# Altium schematic sheet PowerSupply.SchDoc: Iris
size A3; Organization: Toradex AG; Address1: Altsagenstrasse 5; Address2: Horw; Address3: 6048; Address4: Switzerland; DocumentNumber: 3; Revision: V2.0; SheetNumber: 3; SheetTotal: 16
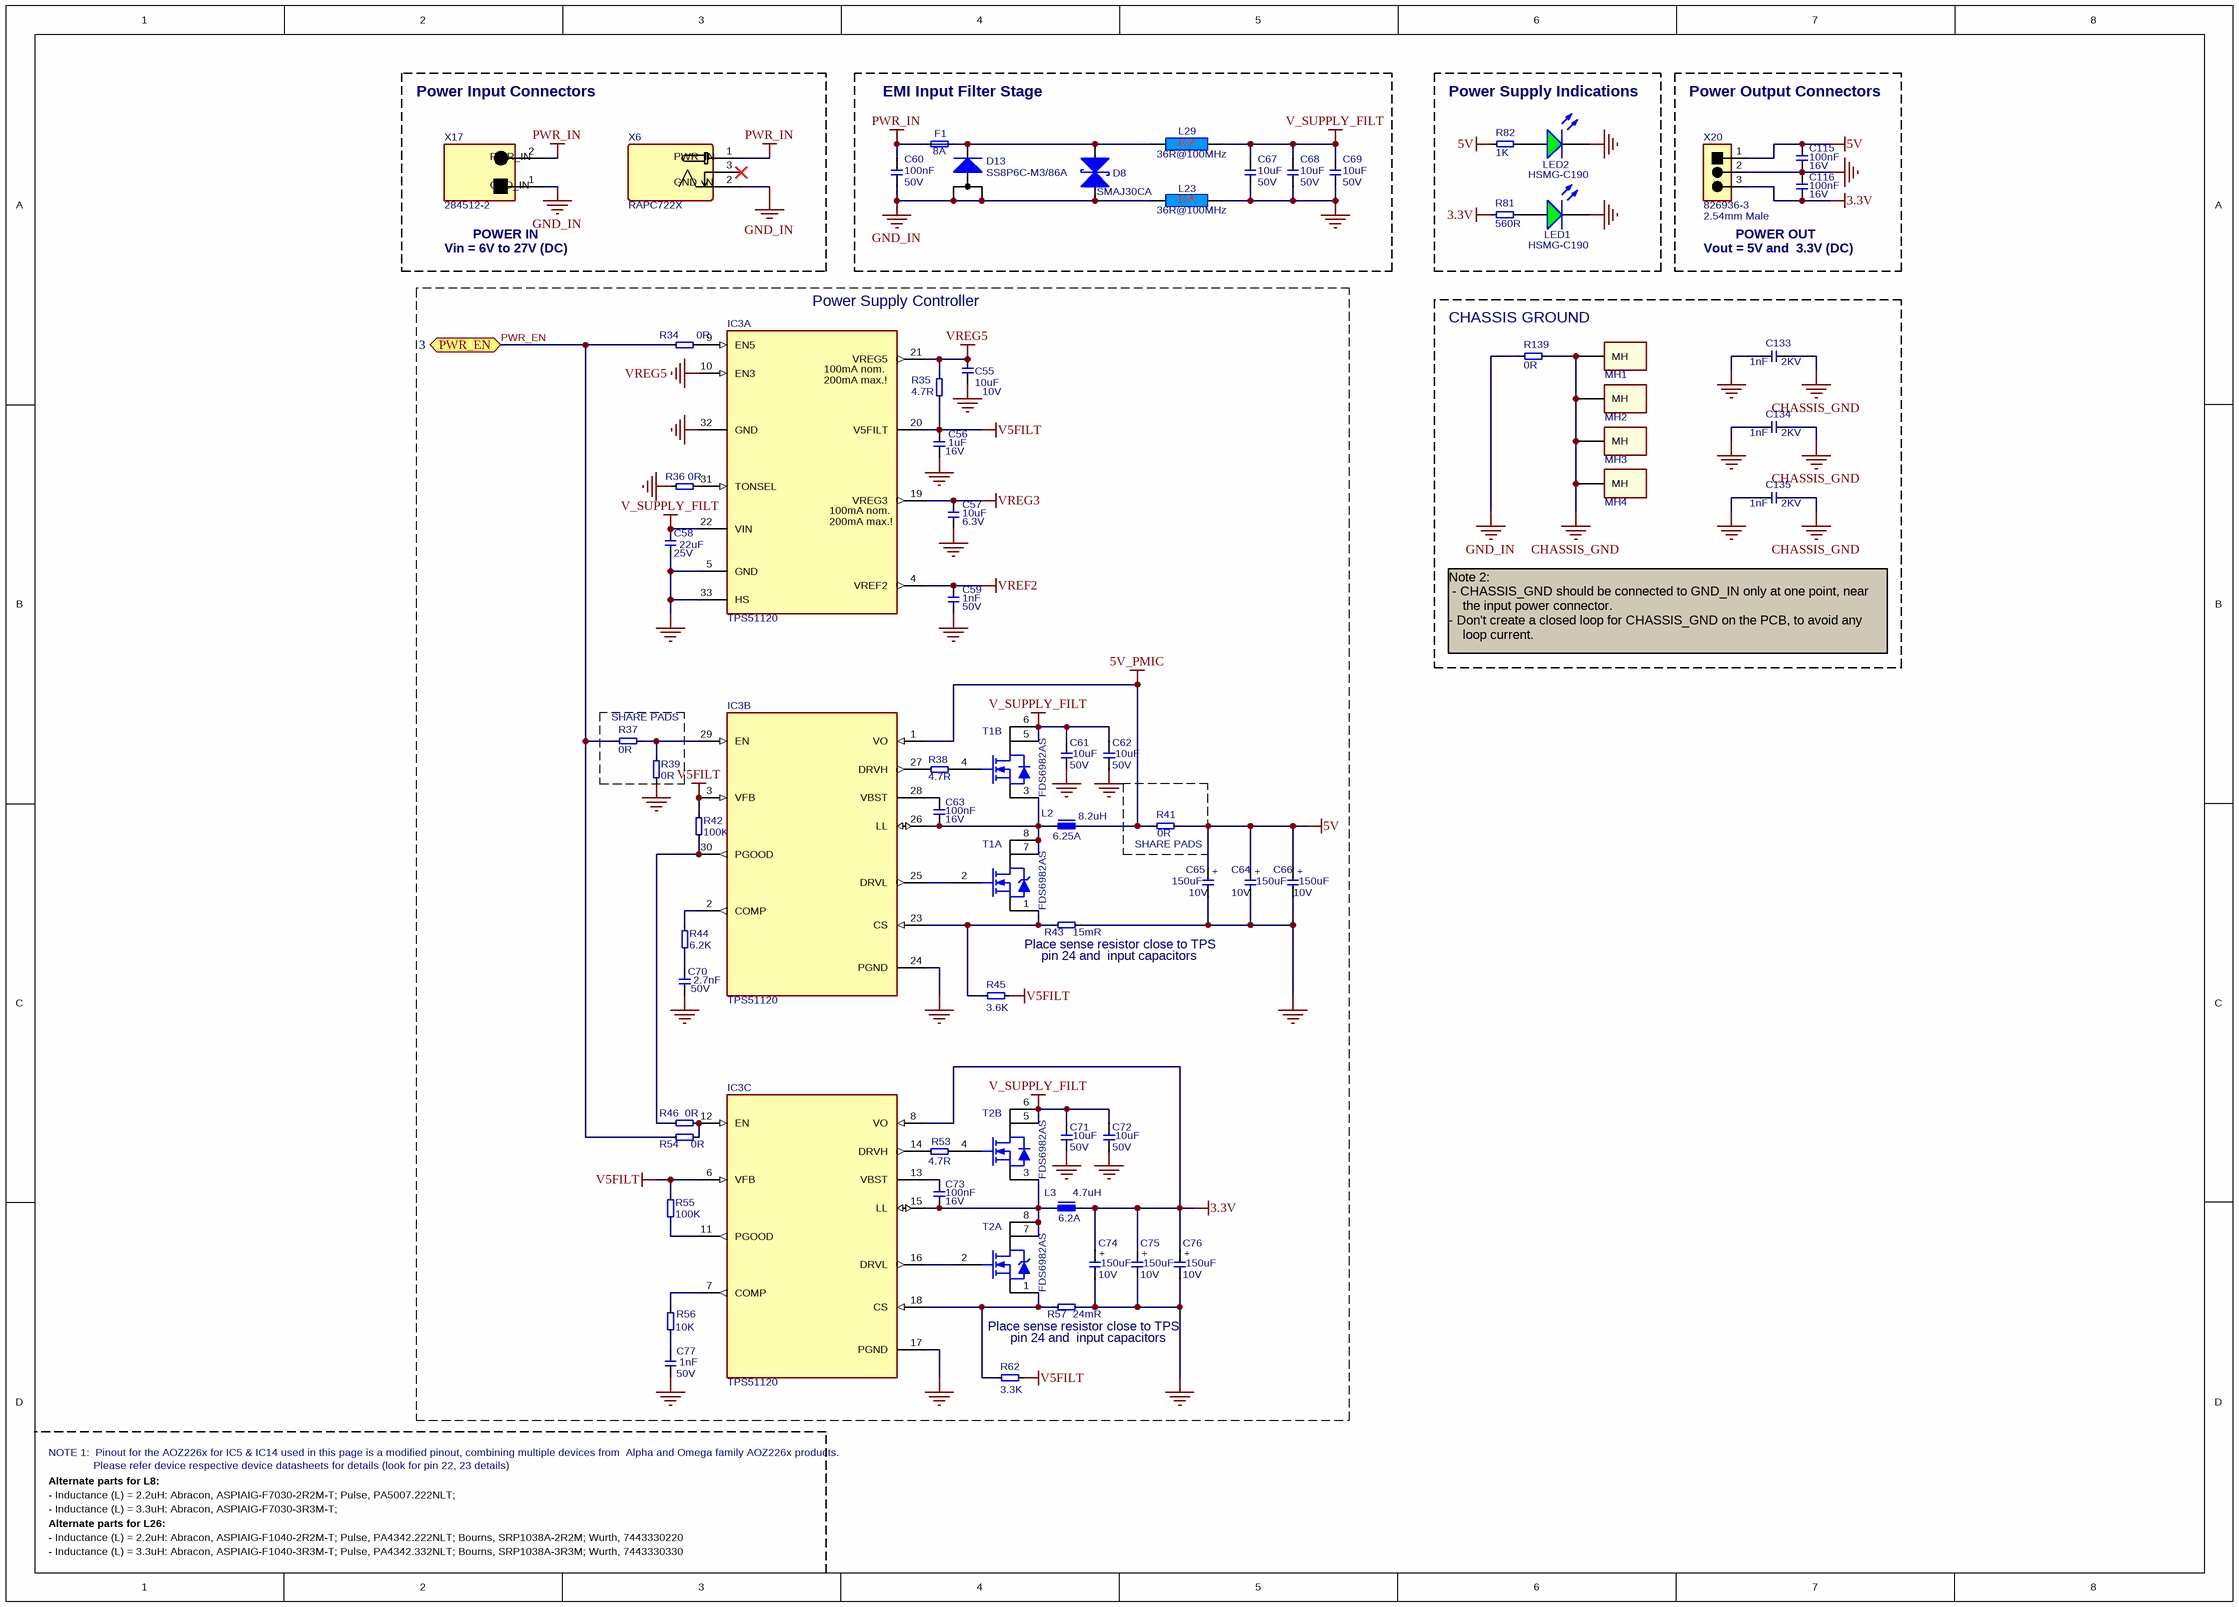
[diagram p0: PowerSupply.SchDoc]

## Parts
C55  Rating: 10V  [T_CAPC0805X125N]  (hidden comment: 10uF)
C56  Rating: 16V  [T_CAPC0603X33N]  (hidden comment: 1uF)
C57  Rating: 6.3V  [T_CAPC0603X33N]  (hidden comment: 10uF)
C58  Rating: 25V  [CAPC3225X160N]  (hidden comment: 22uF)
C59  Rating: 50V  [T_CAPC0603X33N]  (hidden comment: 1nF)
C60  Rating: 50V  [T_CAPC0603X33N]  (hidden comment: 100nF)
C61  Rating: 50V  [CAPC3225X160N]  (hidden comment: 10uF)
C62  Rating: 50V  [CAPC3225X160N]  (hidden comment: 10uF)
C63  Rating: 16V  [T_CAPC0603X33N]  (hidden comment: 100nF)
C64  Rating: 10V  [CAPMP7343X310N]  (hidden comment: 150uF)
C65  Rating: 10V  [CAPMP7343X310N]  (hidden comment: 150uF)
C66  Rating: 10V  [CAPMP7343X310N]  (hidden comment: 150uF)
C67  Rating: 50V  [CAPC3225X160N]  (hidden comment: 10uF)
C68  Rating: 50V  [CAPC3225X160N]  (hidden comment: 10uF)
C69  Rating: 50V  [CAPC3225X160N]  (hidden comment: 10uF)
C70  Rating: 50V  [CAPC1005X60N]  (hidden comment: 2.7nF)
C71  Rating: 50V  [CAPC3225X160N]  (hidden comment: 10uF)
C72  Rating: 50V  [CAPC3225X160N]  (hidden comment: 10uF)
C73  Rating: 16V  [T_CAPC0603X33N]  (hidden comment: 100nF)
C74  Rating: 10V  [CAPMP7343X310N]  (hidden comment: 150uF)
C75  Rating: 10V  [CAPMP7343X310N]  (hidden comment: 150uF)
C76  Rating: 10V  [CAPMP7343X310N]  (hidden comment: 150uF)
C77  Rating: 50V  [T_CAPC0603X33N]  (hidden comment: 1nF)
C115  Rating: 16V  [CAPC1005X60N]  (hidden comment: 100nF)
C116  Rating: 16V  [CAPC1005X60N]  (hidden comment: 100nF)
C133  Rating: 2KV  [T_CAPC1206X180N]  (hidden comment: 1nF)
C134  Rating: 2KV  [T_CAPC1206X180N]  (hidden comment: 1nF)
C135  Rating: 2KV  [T_CAPC1206X180N]  (hidden comment: 1nF)
D8  Manufacturer Part No.: SMAJ30CA  [T_LITTLEFUSE_SMAJ30CA]  (hidden comment: D-Littelfuse-SMAJ30CA-Schottky)
D13  SS8P6C-M3/86A  [T_DIOM_TO277A]
F1  8A  [T_Littelfuse_0458]
IC3  TPS51120  [QFN50P500X500X100-33N]  (parts A,B,C of 3)
L2  Rating: 6.25A  [T_INDM120120X80N]  (hidden comment: 8.2uH)
L3  Rating: 6.2A  [T_INDM102102X45N]  (hidden comment: 4.7uH)
L23  36R@100MHz  [T_Laird_35F0121-0SR-10]
L29  36R@100MHz  [T_Laird_35F0121-0SR-10]
LED1  Manufacturer Part No.: HSMG-C190  [LEDC1608X80N]  (hidden comment: LED)
LED2  Manufacturer Part No.: HSMG-C190  [LEDC1608X80N]  (hidden comment: LED)
MH1  MECH-MountingHoles  [T_MountingHoles]  (value not drawn)  (no BOM)
MH2  MECH-MountingHoles  [T_MountingHoles]  (value not drawn)  (no BOM)
MH3  MECH-MountingHoles  [T_MountingHoles]  (value not drawn)  (no BOM)
MH4  MECH-MountingHoles  [T_MountingHoles]  (value not drawn)  (no BOM)
R34  0R  [T_RESC0603X30N]
R35  4.7R  [RESC1005X40N]
R36  0R  [T_RESC0603X30N]
R37  0R  [T_RESC3216X760N]
R38  4.7R  [RESC1005X40N]
R39  0R  [T_RESC3216X760N]
R41  0R  [CAPC1608X100N]
R42  100K  [T_RESC0603X30N]
R43  15mR  [RESC3316X76N]
R44  6.2K  [RESC1005X40N]
R45  3.6K  [T_RESC0603X30N]
R46  0R  [T_RESC0603X30N]
R53  4.7R  [RESC1005X40N]
R54  0R  [T_RESC0603X30N]
R55  100K  [T_RESC0603X30N]
R56  10K  [RESC1005X40N]
R57  24mR  [RESC3316X76N]
R62  3.3K  [T_RESC0603X30N]
R81  560R  [RESC1005X40N]
R82  1K  [RESC1005X40N]
R139  0R  [T_RESC3216X760N]
T1  FDS6982AS  [SOIC127P600X173-8N]  (parts A,B of 2)
T2  FDS6982AS  [SOIC127P600X173-8N]  (parts A,B of 2)
X6  RAPC722X  [CTBP9358/3]
X17  284512-2  [T_TYCO_284512-2]
X20  826936-3  [T_TYCO_826936-3]

## Blocks framed on the sheet
Power Input Connectors: X6 X17
EMI Input Filter Stage: C60 C67-C69 D8 D13 F1 L23 L29
Power Supply Indications: LED1 LED2 R81 R82
Power Output Connectors: C115 C116 X20
Power Supply Controller: C55-C59 C61-C66 C70-C77 IC3 L2 L3 R34-R36 R38 R42-R46 R53-R57 R62 T1 T2
CHASSIS GROUND: C133-C135 MH1-MH4 R139
SHARE PADS: R37 R39
SHARE PADS: R41

## Ports
PWR_EN (bidir, see 3)

## Nets
3.3V: C74.1 C75.1 C76.1 C116.1 IC3.8(VO) L3.2 R81.2 X20.3
5V: C64.1 C65.1 C66.1 C115.2 R41.2 R82.2 X20.1
5V_PMIC: IC3.1(VO) L2.2 R41.1
CHASSIS_GND: C133.1 C134.1 C135.1 MH1.1(MH) MH2.1(MH) MH3.1(MH) MH4.1(MH) R139.2
GND: C55.1 C56.1 C57.1 C58.1 C59.1 C61.1 C62.1 C64.2 C65.2 C66.2 C67.1 C68.1 C69.1 C70.1 C71.1 C72.1 C74.2 C75.2 C76.2 C77.1 C115.1 C116.2 C133.2 C134.2 C135.2 IC3.5(GND) IC3.17(PGND) IC3.24(PGND) IC3.32(GND) IC3.33(HS) L23.2 LED1.1(K) LED2.1(K) R36.1 R39.1 R43.2 R57.2 X20.2
GND_IN: C60.1 D8.2(Anode) D13.A1 D13.A2 L23.1 R139.1 X6.2(PWR_IN) X17.1(GND_IN)
PWR_IN: C60.2 F1.1 X6.1(GND_IN) X17.2(PWR_IN)
V5FILT: C56.2 IC3.3(VFB) IC3.6(VFB) IC3.20(V5FILT) R35.1 R42.2 R45.2 R55.2 R62.2
V_SUPPLY_FILT: C58.2 C61.2 C62.2 C67.2 C68.2 C69.2 C71.2 C72.2 IC3.22(VIN) L29.2 T1.5(D) T1.6(D) T2.5(D) T2.6(D)
VREF2: C59.2 IC3.4(VREF2)
VREG3: C57.2 IC3.19(VREG3)
VREG5: C55.2 IC3.10(EN3) IC3.21(VREG5) R35.2
PWR_EN: R34.1 R37.1 R54.1 ; port PWR_EN
NetC63_1: C63.1 IC3.26(LL) L2.1 T1.3(S) T1.7(D) T1.8(D)
NetC63_2: C63.2 IC3.28(VBST)
NetC70_2: C70.2 R44.1
NetC73_1: C73.1 IC3.15(LL) L3.1 T2.3(S) T2.7(D) T2.8(D)
NetC73_2: C73.2 IC3.13(VBST)
NetC77_2: C77.2 R56.1
NetD8_1: D8.1(Cathode) D13.K F1.2 L29.1
NetIC3_2: IC3.2(COMP) R44.2
NetIC3_7: IC3.7(COMP) R56.2
NetIC3_9: IC3.9(EN5) R34.2
NetIC3_11: IC3.11(PGOOD) R55.1
NetIC3_12: IC3.12(EN) R46.2 R54.2
NetIC3_14: IC3.14(DRVH) R53.1
NetIC3_16: IC3.16(DRVL) T2.2(G)
NetIC3_18: IC3.18(CS) R57.1 R62.1 T2.1(S)
NetIC3_23: IC3.23(CS) R43.1 R45.1 T1.1(S)
NetIC3_25: IC3.25(DRVL) T1.2(G)
NetIC3_27: IC3.27(DRVH) R38.1
NetIC3_29: IC3.29(EN) R37.2 R39.2
NetIC3_30: IC3.30(PGOOD) R42.1 R46.1
NetIC3_31: IC3.31(TONSEL) R36.2
NetLED1_2: LED1.2(A) R81.1
NetLED2_2: LED2.2(A) R82.1
NetR38_2: R38.2 T1.4(G)
NetR53_2: R53.2 T2.4(G)

Not connected (* = marked no-connect by the designer): X6 3(PWR_IN)*

## Notes on the sheet
- (near X17) Vin = 6V to 27V (DC)
- (near X17) POWER IN
- Vout = 5V and  3.3V (DC)
- (near X20) 2.54mm Male
- POWER OUT
- Note 2:
  - CHASSIS_GND should be connected to GND_IN only at one point, near
  the input power connector.
  - Don't create a closed loop for CHASSIS_GND on the PCB, to avoid any
  loop current.
- (near R43) Place sense resistor close to TPS
- (near R43) pin 24 and  input capacitors
- (near R57) Place sense resistor close to TPS
- pin 24 and  input capacitors
- NOTE 1:  Pinout for the AOZ226x for IC5 & IC14 used in this page is a modified pinout, combining multiple devices from  Alpha and Omega family AOZ226x products.
- Alternate parts for L8:
- Please refer device respective device datasheets for details (look for pin 22, 23 details)
- Alternate parts for L26:
- - Inductance (L) = 3.3uH: Abracon, ASPIAIG-F1040-3R3M-T; Pulse, PA4342.332NLT; Bourns, SRP1038A-3R3M; Wurth, 7443330330
- - Inductance (L) = 2.2uH: Abracon, ASPIAIG-F1040-2R2M-T; Pulse, PA4342.222NLT; Bourns, SRP1038A-2R2M; Wurth, 7443330220
- - Inductance (L) = 3.3uH: Abracon, ASPIAIG-F7030-3R3M-T;
- - Inductance (L) = 2.2uH: Abracon, ASPIAIG-F7030-2R2M-T; Pulse, PA5007.222NLT;
- Title
- Size:
- Date:
- A3
- Number:
- Time:
- Revision:
- Sheet
- of
- File:
- (in symbol C-TA-150uF-10V-10%-7343) +
- (in symbol IC-TI-TPS51120, part A) 100mA nom.; 200mA max.!

## Library data of the parts
C55 = C-X5R-10uF-10V-20%-0805: Capacitor Ceramic X5R 10uF 10V 20% 0805; Tolerance: 20%; Type: X5R; Value: 10uF
C56 = C-X5R-1uF-16V-20%-0603: Capacitor Ceramic X5R 1uF 16V 20% 0603; Tolerance: 20%; Type: X5R; Value: 1uF
C57 = C-X5R-10uF-6.3V-20%-0603: Capacitor Ceramic X5R 10uF 6.3V 20% 0603; Tolerance: 20%; Type: X5R; Value: 10uF
C58 = C-X5R-22uF-25V-20%-1210: Capacitor Ceramic X5R 22uF 25V 20% 1210; Tolerance: 20%; Type: X5R; Value: 22uF
C59 C77 = C-X7R-1nF-50V-10%-0603: Capacitor Ceramic X7R 1nF 50V 10% 0603; Tolerance: 10%; Type: X7R; Value: 1nF
C60 = C-X7R-100nF-50V-10%-0603: Capacitor Ceramic X7R 100nF 50V 10% 0603; Tolerance: 10%; Type: X7R; Value: 100nF
C61 C62 C71 C72 = C-X5R-10uF-50V-20%-1210: Capacitor Ceramic X5R 10uF 50V 20% 1210; Tolerance: 20%; Type: X5R; Value: 10uF
C63 C73 = C-X7R-100nF-16V-10%-0603: Capacitor Ceramic X7R 100nF 16V 10% 0603; Tolerance: 10%; Type: X7R; Value: 100nF
C64-C66 C74-C76 = C-TA-150uF-10V-10%-7343: Capacitor TA 150uF 10V 20% 7343; Tolerance: 10%; Type: TA; Value: 150uF
C67-C69 = C-X5R-10uF-50V-10%-1210: Capacitor Ceramic X5R 10uF 50V 10% 1210; Tolerance: 10%; Type: X5R; Value: 10uF
C70 = C-X7R-2.7nF-50V-10%-0402: Capacitor Ceramic X7R 2.7nF 50V 10% 0402; Tolerance: 10%; Type: X7R; Value: 2.7nF
C115 C116 = C-X7R-100nF-16V-10%-0402: Capacitor Ceramic X7R 100nF 16V 10% 0402; Tolerance: 10%; Type: X7R; Value: 100nF
C133-C135 = C-X7R-1nF-2KV-10%-1206: Capacitor Ceramic X7R 1nF 2KV 10% 1206; Tolerance: 10%; Type: X7R; Value: 1nF
D8 = D-Littelfuse-SMAJ30CA-Schottky: Bidirectional ESD protection; Manufacturer Name: Littelfuse
D13 = D-Vishay-SS8P6C-M3/86A: Diode Schottky, SS8P6C-M3/86A, 60V(Vrrm), 8A(If); Manufacturer: Vishay; Manufacturer Part Number: SS8P6C-M3/86A
F1 = F-Littelfuse-0458008.DR: Fast Fuse, Rated 8A, 63V(DC), 1206 (3216 Metric); Manufacturer Part No.: 0458008.DR; Manufacturer Name: Littelfuse; Value: 8A
IC3 = IC-TI-TPS51120: Power Supply Controller; Manufacturer Name: Texas Instruments; Manufacturer Part No.: TPS51120
L2 = L-Wurth-744771008-8.2uH-6.25A-20%: Inductance 8.2uH 6.25A 20%; Manufacturer Name: Wurth; Tolerance: 20%; Manufacturer Part No.: 744771008; Value: 8.2uH
L3 = L-Wurth-7447797470-4.7uH-6.2A-20%: Inductance 4.7uH 6.2A 20%; Manufacturer Name: Wurth; Tolerance: 20%; Manufacturer Part No.: 7447797470; Value: 4.7uH
L23 L29 = L-Laird-35F0121-0SR-10-10A-25%: Power Supply FB 10A; Tolerance: 25%; Rating: 10A; Value: 36R@100MHz
LED1 LED2 = LED-Avago-HSMG-C190: Surface mount LED green 20mA; Manufacturer Name: Avago
MH1-MH4 = MECH-MountingHoles: PCB Mounting Holes, hole diemeter = 3.2mm, pad diameter = 6.2mm
R34 R36 R46 R54 = R-0R-63mW-1%-0603: Resistor 0 ohm 63mW 1% 0603; Rating: 63mW; Tolerance: 1%; Value: 0R
R35 R38 R53 = R-4.7R-63mW-5%-0402: Resistor 4.7 ohm 63mW 5% 0402; Rating: 63mW; Tolerance: 5%; Value: 4.7R
R37 R39 R139 = R-0R-63mW-1%-1206: Resistor 0 ohm 63mW 1% 1206; Rating: 63mW; Tolerance: 1%; Value: 0R
R41 = R-0R-63mW-1%-1210: Resistor 0 ohm 63mW 1%; Rating: 63mW; Tolerance: 1%; Value: 0R
R42 R55 = R-100KR-63mW-5%-0603: Resistor 100 Kohm 63mW 5% 0603; Value: 100KR; Rating: 63mW; Tolerance: 5%
R43 = R-15mR-250mW-1%-1206: Resistor 15 mohm 250mW 1% 1206; Rating: 250mW; Tolerance: 1%; Value: 15mR
R44 = R-6.2KR-63mW-1%-0402: Resistor 6.2 Kohm 63mW 1% 0402; Value: 6.2KR; Rating: 63mW; Tolerance: 1%
R45 = R-3.6KR-63mW-1%-0603: Resistor 3.6 Kohm 63mW 1% 0603; Value: 3.6KR; Rating: 63mW; Tolerance: 1%
R56 = R-10KR-63mW-1%-0402: Resistor 10 Kohm 63mW 1% 0402; Value: 10KR; Rating: 63mW; Tolerance: 1%
R57 = R-24mR-250mW-1%-1206: Resistor 24 mohm 250mW 1% 1206; Rating: 250mW; Tolerance: 1%; Value: 24mR
R62 = R-3.3KR-63mW-1%-0603: Resistor 3.3 Kohm 63mW 1% 0603; Value: 3.3KR; Rating: 63mW; Tolerance: 1%
R81 = R-560R-63mW-5%-0402: Resistor 560 ohm 63mW 5% 0402; Rating: 63mW; Tolerance: 5%; Value: 560R
R82 = R-1KR-63mW-5%-0402: Resistor 1 Kohm 63mW 5% 0402; Rating: 63mW; Tolerance: 5%; Value: 1K
T1 T2 = T-Fairchild-FDS6982AS-N: N-Channel PowerTrench SyncFET; Manufacturer Name: Fairchild; Manufacturer Part No.: FDS6982AS
X6 = CON-SwitchCraft-RAPC722X: Barrel Power Connector; Manufacturer Part No.: RAPC722X; Manufacturer Name: SwitchCraft
X17 = CON-Tyco-284512-2-1x2-3.5mm: Terminal Block Power Connector; Manufacturer Name: Tyco; No. of ways: 1x2; Pitch: 3.5mm; Manufacturer Part No.: 284512-2
X20 = CON-Tyco-826936-3-1X3-2.54mm: Header, 3-Pin; Manufacturer Name: Tyco; No. of ways: 1X3; Pitch: 2.54mm; Manufacturer Part No.: 826936-3